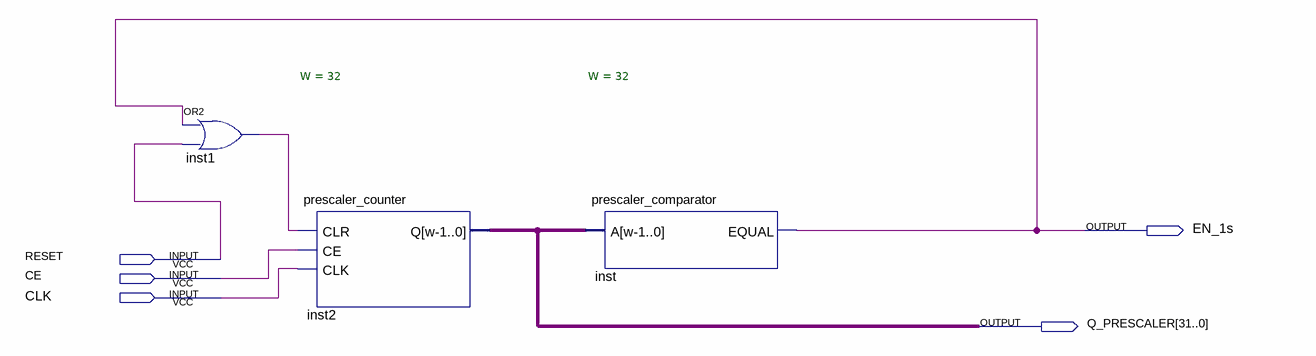
[diagram p0: schematic sheet]
// Quartus schematic prescaler.bdf as structural Verilog: 3 symbols, 5 pins
module prescaler (
  input  RESET,
  input  CE,
  input  CLK,
  output EN_1s,
  output [31:0] Q_PRESCALER
);

  wire inst1_out;

  or inst1 (inst1_out, EN_1s, RESET);
  prescaler_counter #(.W(32)) inst2 (.CLR(inst1_out), .CE(CE), .CLK(CLK), .Q(Q_PRESCALER));
  prescaler_comparator #(.W(32)) inst (.A(Q_PRESCALER), .EQUAL(EN_1s));
endmodule
